# Altium schematic sheet Main.SchDoc
size 420 x 297 mm
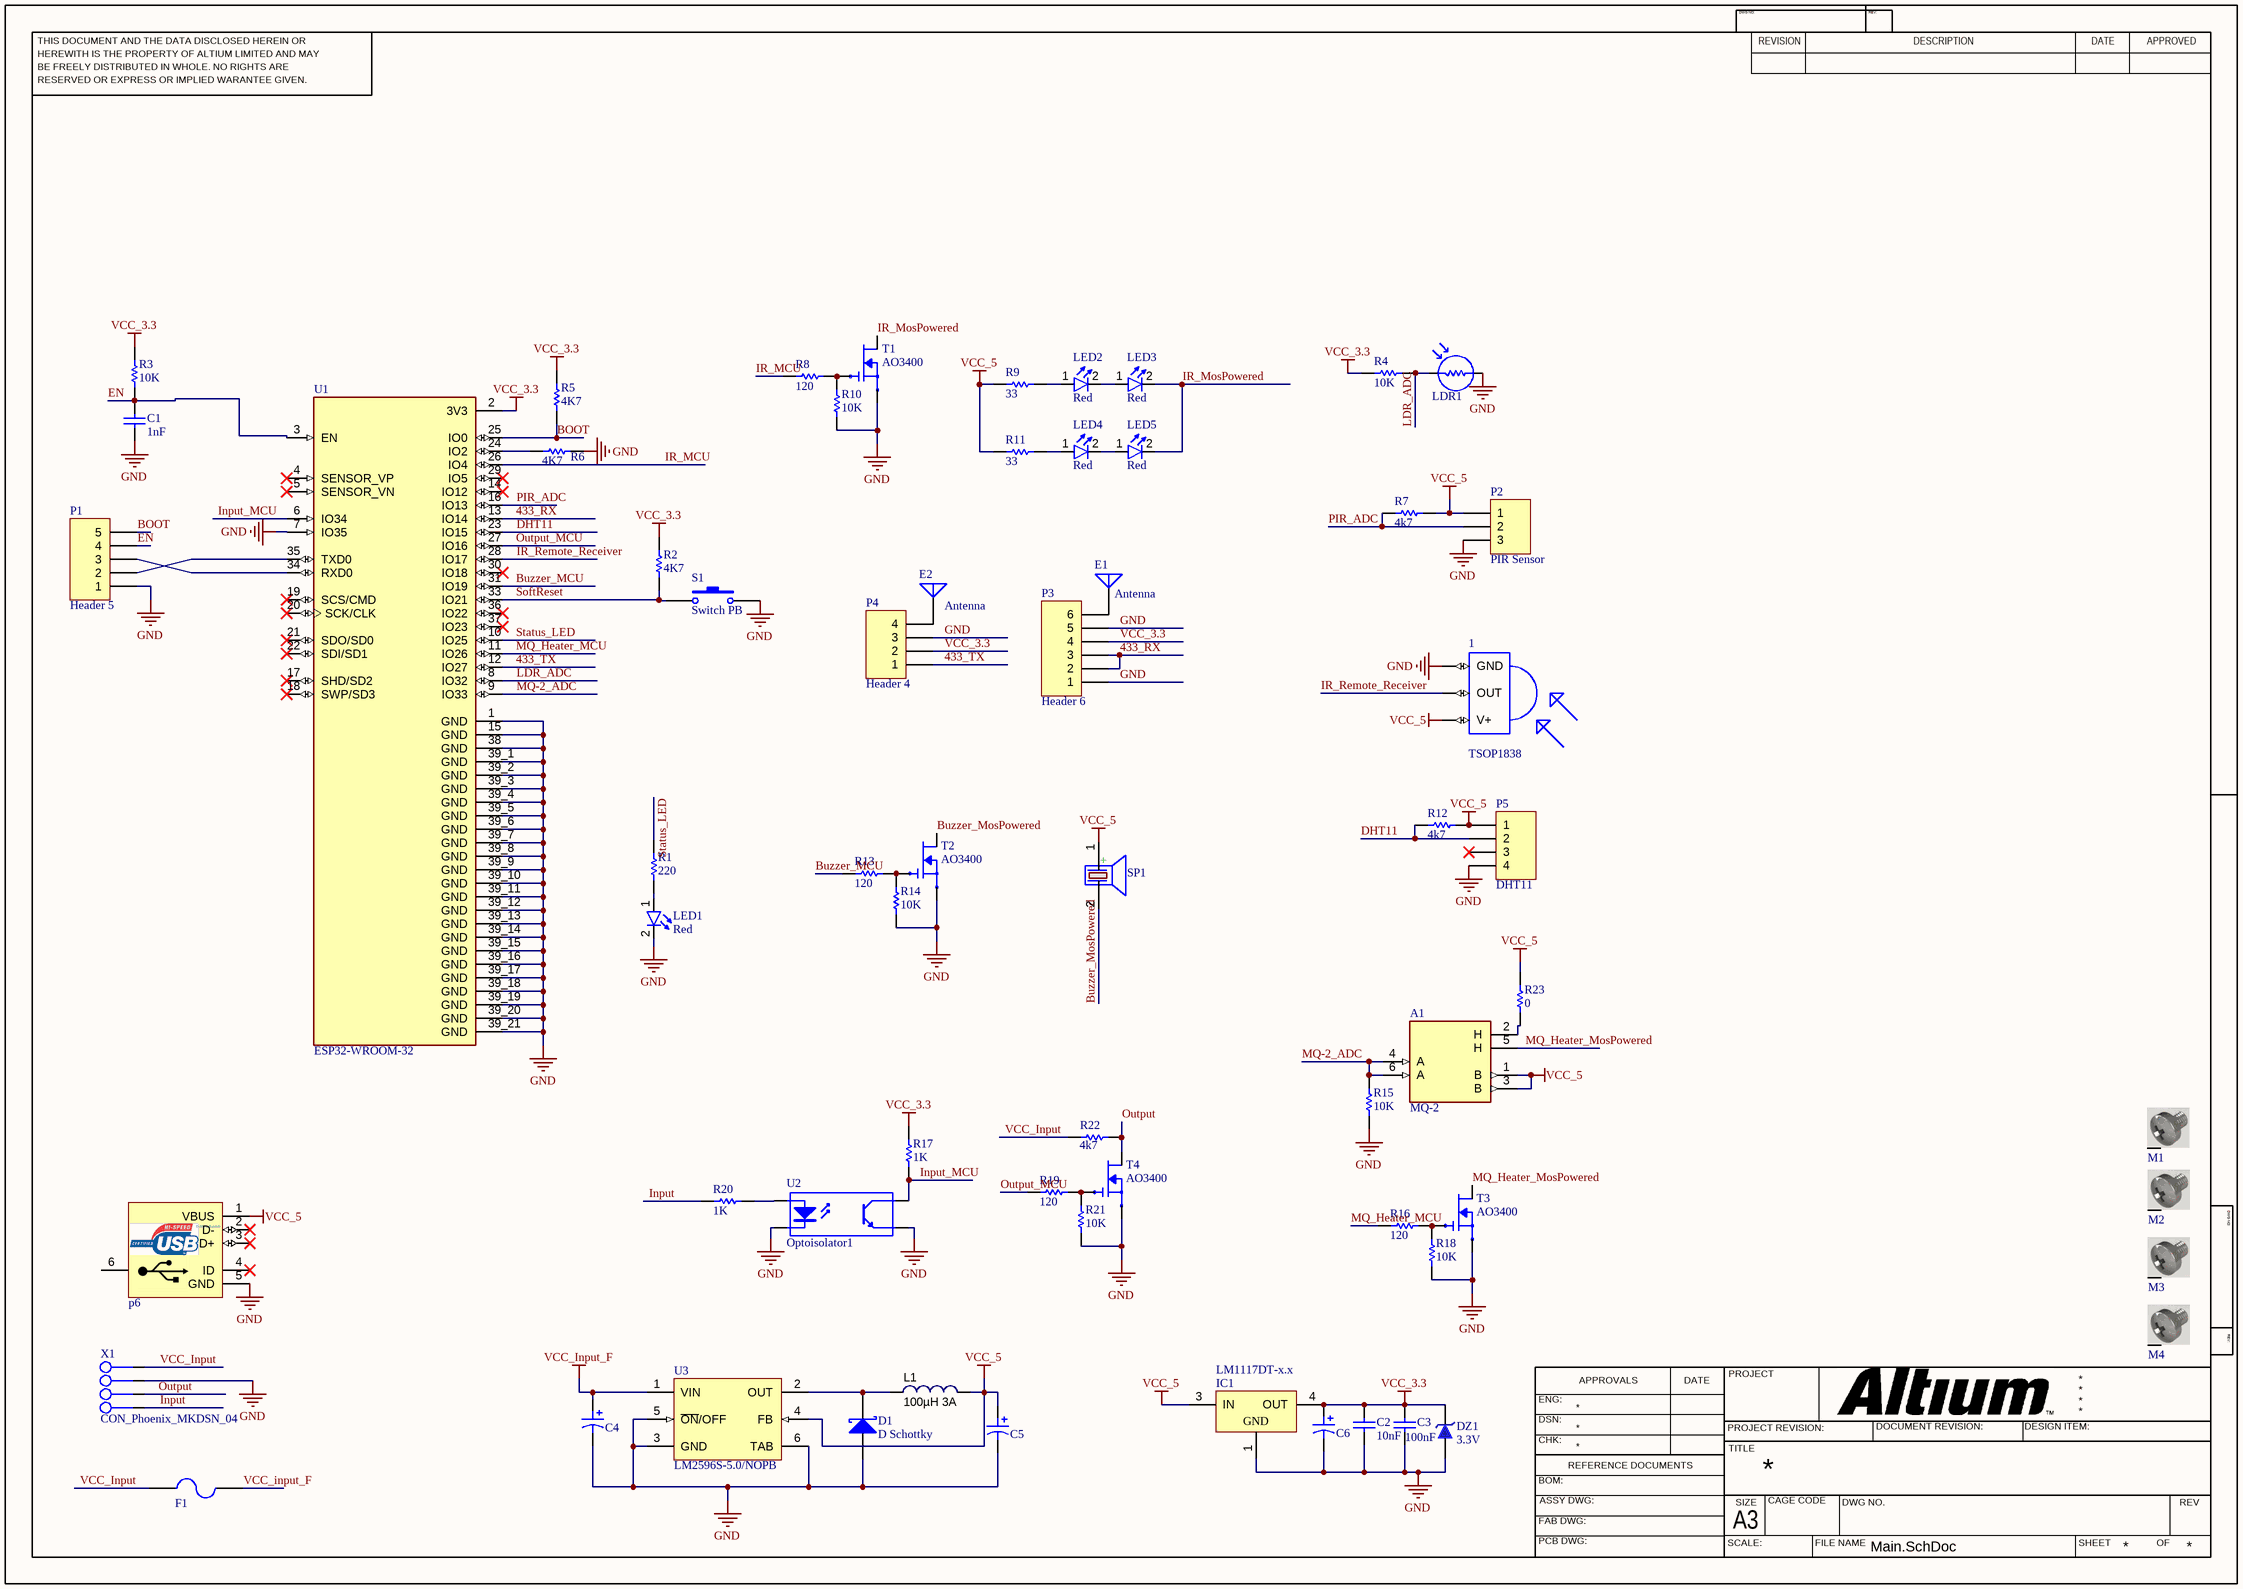
[diagram p0: Main.SchDoc]

## Parts
1  TSOP1838  [TSOP18XX]
A1  MQ-2  [XDCR_MQ-7]
C1  1nF  [CAPC4817X12N]
C2  10nF  [CAPC3413X12N]
C3  100nF  [CAPC3413X12N]
C4  220uF16V  [Cap electrolitic radial 6x7-2.5]  (value not drawn)
C5  (no value)  [Cap electrolitic radial 6x7-2.5]
C6  2200uf  [Cap electrolitic radial 6x7-2.5]  (value not drawn)
D1  D Schottky  [SMB]
DZ1  3.3V  [SOD80, LL-34]
E1  Antenna  [PIN1]
E2  Antenna  [PIN1]
F1  F=1.0 A  [1206 FUSE]  (value not drawn)
IC1  LM1117DT-x.x  [TD03B_N]
L1  100µH 3A  [Inductor 10x12 (200 mils)]
LDR1  PhotoCell  [PhotoCell]  (value not drawn)
LED1  Red  [LED-5mm]
LED2  Red  [LED-5mm-IR]
LED3  Red  [LED-5mm-IR]
LED4  Red  [LED-5mm-IR]
LED5  Red  [LED-5mm-IR]
M1  Screw  [Board Screw_No Silk]  (value not drawn)
M2  Screw  [Board Screw_No Silk]  (value not drawn)
M3  Screw  [Board Screw_No Silk]  (value not drawn)
M4  Screw  [Board Screw_No Silk]  (value not drawn)
P1  Header 5  [HDR1X5]
P2  PIR Sensor  [HDR1X3]
P3  Header 6  [HDR1X6]
P4  Header 4  [HDR1X4]
P5  DHT11  [HDR1X4]
p6  USB Connector  [USB_AB_BM_SHS]  (value not drawn)
R1  220  [RESC3413X04N]
R2  4K7  [RESC3413X04N]
R3  10K  [RESC3413X04N]
R4  10K  [RESC3413X04N]
R5  4K7  [RESC3413X04N]
R6  4K7  [RESC3413X04N]
R7  4k7  [RESC3413X04N]
R8  120  [RESC3413X04N]
R9  33  [RESC4817X04N]
R10  10K  [RESC3413X04N]
R11  33  [RESC4817X04N]
R12  4k7  [RESC3413X04N]
R13  120  [RESC3413X04N]
R14  10K  [RESC3413X04N]
R15  10K  [RESC3413X04N]
R16  120  [RESC3413X04N]
R17  1K  [RESC3413X04N]
R18  10K  [RESC3413X04N]
R19  120  [RESC3413X04N]
R20  1K  [RESC3413X04N]
R21  10K  [RESC3413X04N]
R22  4k7  [RESC3413X04N]
R23  0  [RESC4817X04N]
S1  Switch PB  [Switch - Push to On]
SP1  (no value)  [BUZZER 7.62mm DC]
T1  AO3400  [SOT23]
T2  AO3400  [SOT23]
T3  AO3400  [SOT23]
T4  AO3400  [SOT23]
U1  ESP32-WROOM-32  [MODULE_ESP32-WROOM-32]
U2  Optoisolator1  [DIP-4]
U3  LM2596S-5.0/NOPB  [TS5B_N]
X1  CON_Phoenix_MKDSN_04  [CON_MKDSN1,5/4-5,08]

## Nets
GND: 1.GND C1.1 C2.1 C3.1 C4.2 C5.2 C6.2 D1.1(A) DZ1.1 IC1.1(GND) LDR1.2 LED1.2(K) P1.1 P2.3 P3.1 P3.5 P4.3 P5.4 p6.5(GND) R6.1 R10.1 R14.1 R15.2 R18.1 R21.1 S1.2 T1.2(S) T2.2(S) T3.2(S) T4.2(S) U1.1(GND) U1.7(IO35) U1.15(GND) U1.38(GND) U1.39_1(GND) U1.39_2(GND) U1.39_3(GND) U1.39_4(GND) U1.39_5(GND) U1.39_6(GND) U1.39_7(GND) U1.39_8(GND) U1.39_9(GND) U1.39_10(GND) U1.39_11(GND) U1.39_12(GND) U1.39_13(GND) U1.39_14(GND) U1.39_15(GND) U1.39_16(GND) U1.39_17(GND) U1.39_18(GND) U1.39_19(GND) U1.39_20(GND) U1.39_21(GND) U2.2(K) U2.3(E) U3.3(GND) U3.5(~{ON}/OFF) U3.6(TAB) X1.3
VCC_3.3: C2.2 C3.2 C6.1 DZ1.2 IC1.4(OUT) P3.4 P4.2 R2.2 R3.2 R4.2 R5.2 R17.2 U1.2(3V3)
VCC_5: 1.VCC(V+) A1.1(B) A1.3(B) C5.1 IC1.3(IN) L1.2 P2.1 P5.1 p6.1(VBUS) R7.1 R9.2 R11.2 R12.1 R23.1 SP1.1(+) U3.4(FB)
VCC_input_F: C4.1 F1.2 U3.1(VIN)
433_RX: P3.2 P3.3 U1.13(IO14)
433_TX: P4.1 U1.12(IO27)
BOOT: P1.5 R5.1 U1.25(IO0)
Buzzer_MCU: R13.1 U1.31(IO19)
Buzzer_MosPowered: SP1.2(-) T2.3(D)
DHT11: P5.2 R12.2 U1.23(IO15)
EN: C1.2 P1.4 R3.1 U1.3(EN)
Input: R20.2 X1.1
Input_MCU: R17.1 U1.6(IO34) U2.4(C)
IR_MCU: R8.1 U1.26(IO4)
IR_MosPowered: LED3.2(K) LED5.2(K) T1.3(D)
IR_Remote_Receiver: 1.OUT U1.28(IO17)
LDR_ADC: LDR1.1 R4.1 U1.8(IO32)
MQ-2_ADC: A1.4(A) A1.6(A) R15.1 U1.9(IO33)
MQ_Heater_MCU: R16.1 U1.11(IO26)
MQ_Heater_MosPowered: A1.5(H) T3.3(D)
Output: R22.2 T4.3(D) X1.2
Output_MCU: R19.1 U1.27(IO16)
PIR_ADC: P2.2 R7.2 U1.16(IO13)
SoftReset: R2.1 S1.1 U1.33(IO21)
Status_LED: R1.2 U1.10(IO25)
VCC_Input: F1.1 R22.1 X1.4
NetA1_2: A1.2(H) R23.2
NetD1_2: D1.2(K) L1.1 U3.2(OUT)
NetE1_1: E1.1(A) P3.6
NetE2_1: E2.1(A) P4.4
NetLED1_1: LED1.1(A) R1.1
NetLED2_1: LED2.1(A) R9.1
NetLED2_2: LED2.2(K) LED3.1(A)
NetLED4_1: LED4.1(A) R11.1
NetLED4_2: LED4.2(K) LED5.1(A)
NetP1_2: P1.2 U1.35(TXD0)
NetP1_3: P1.3 U1.34(RXD0)
NetR6_2: R6.2 U1.24(IO2)
NetR8_2: R8.2 R10.2 T1.1(G)
NetR13_2: R13.2 R14.2 T2.1(G)
NetR16_2: R16.2 R18.2 T3.1(G)
NetR19_2: R19.2 R21.2 T4.1(G)
NetR20_1: R20.1 U2.1(A)

Not connected (* = marked no-connect by the designer): M1 S; M2 S; M3 S; M4 S; P5 3*; p6 2(D-)* 3(D+)* 4(ID)* 6(MH); U1 4(SENSOR_VP)* 5(SENSOR_VN)* 14(IO12)* 17(SHD/SD2)* 18(SWP/SD3)* 19(SCS/CMD)* 20(SCK/CLK)* 21(SDO/SD0)* 22(SDI/SD1)* 29(IO5)* 30(IO18)* 36(IO22)* 37(IO23)*

## Notes on the sheet
- THIS DOCUMENT AND THE DATA DISCLOSED HEREIN OR
- HEREWITH IS THE PROPERTY OF ALTIUM LIMITED AND MAY
- DWG NO:
- REVISION
- REV:
- DESCRIPTION
- DATE
- APPROVED
- BE FREELY DISTRIBUTED IN WHOLE. NO RIGHTS ARE
- RESERVED OR EXPRESS OR IMPLIED WARANTEE GIVEN.
- ENG:
- APPROVALS
- PROJECT
- DSN:
- CHK:
- REFERENCE DOCUMENTS
- PROJECT REVISION:
- TITLE
- DOCUMENT REVISION:
- DESIGN ITEM:
- BOM:
- FAB DWG:
- PCB DWG:
- ASSY DWG:
- SCALE:
- A3
- SIZE
- CAGE CODE
- FILE NAME
- DWG NO.
- SHEET
- OF
- REV
- (in symbol USB AB MICRO CONNECTOR) D:AbbasBasereh

## Library data of the parts
1 = TSOP1838: IR Remote Receiver 38KHz 35m 3-Pin; MF: Vishay; Price: None; SnapEDA_Link: https://www.snapeda.com/parts/TSOP1838/Vishay/view-part/561684/?ref=snap; Availability: Unavailable; Value: *; MP: TSOP1838; Package: None
A1 = MQ-7: Gas Sensor, High sensitivity to carbon monoxide; MF: Hanwei Electronics Co., Ltd; Price: None; Availability: Unavailable; MP: MQ-7; Package: Package; SnapEDA_Link: https://www.snapeda.com/parts/MQ-7/Hanwei%20Electronics%20Co.,%20Ltd/view-part/5661821/?ref=snap; Check_prices: https://www.snapeda.com/parts/MQ-7/Hanwei%20Electronics%20Co.,%20Ltd/view-part/5661821/?ref=eda; Value: *
C1 = CAP SMD 1206: CAP 1206; Designer: Abbas Basereh; Desc.: CAP SMD 1206; Data: 16-12-2016
C2 C3 = CAP SMD 0805: CAP 0805; Designer: Abbas Basereh; Desc.: CAP SMD 0805; Data: 16-12-2016
C4 = Cap ELECTROLITIC TOTAL SIZE: Cap electrolitic radial; Designer: Abbas Basereh; Data: 16-12-2016; Part. No: *; VALUE: 220uF16V
C5 C6 = Cap ELECTROLITIC TOTAL SIZE: Cap electrolitic radial; Designer: Abbas Basereh; VALUE: 2200uF6.3V; Data: 16-12-2016; Part. No: *
D1 = D Schottky: Schottky Diode; PartNumber: 1N5822; Published: 8-Jun-2000; LatestRevisionDate: 17-Jul-2002; LatestRevisionNote: Re-released for DXP Platform.; PackageReference: SMB; Publisher: Altium Limited; PackageDescription: DO-214-AA/SMB; 2 C-Bend Leads; Body 5.3 x 3.6 mm, inc. leads (LxW); Code_JEDEC: DO-214-AA
DZ1 = ZENER GENERAL DIODE: DIODE ZENER GENERAL; Published: 2017-1-12; PackageVersion: 2017-1-12; PackageReference: DO 35; Publisher: Abbas Basereh; PackageDescription: DIODE GEN ZENER; ComponentLink1Description: Manufacturer Link; ComponentLink2Description: Datasheet; VALUE: 3.3V
E1 E2 = Antenna: Generic Antenna; Published: 24-Mar-1999; LatestRevisionDate: 17-Jul-2002; LatestRevisionNote: Re-released for DXP Platform.; PackageReference: PIN1; Publisher: Altium Limited
F1 = Fuse SMD1206: SMD Fuses 1206; Designer: Abbas Basereh; Desc.: SMD Fuses 1206; Data: 16-12-2016
IC1 = LM1117DT-3.3: x.x Volt, 800mA Low-Dropout Linear Regulator, 3-pin TO-252; Manufacturer: National Semiconductor; PackageTopMarking: NSUZXYTT*LM1117*DT-X.X; PowerWise: N; CompType: LDO IC; DatasheetVersion: Apr-2006; PackageVersion: revD, Feb-2009; PackageReference: TD03B; PackageDescription: TO252, Molded, Jedec, 6.8 x 6.10 x 2.30mm Body, 3 Lead, 2.28mm Pitch, Surface Mount; Supplier 1: Farnell; Supplier 2: Farnell; PartNumber: LM1117DT-3.3; RoHS: N; PinCount: 3; Code_JEDEC: TO-252-AA; ComponentLink1Description: LM1117 Datasheet; ComponentLink1URL: http://www.national.com/ds/LM/LM1117.pdf; ComponentLink2Description: LM1117 Web Page; ComponentLink2URL: http://www.national.com/pf/LM/LM1117.html; ComponentLink3Description: TD03B Package Page; ComponentLink3URL: http://www.national.com/packaging/folders/td03b.html
L1 = POWER INDUCTOR 10x12 (200 mils): Tolerance: ±20%; Type: Ferrite Core; SCDType: source; Package / Case: POWER INDUCTOR 10x12 (200 mils); Supplier 1: Digi-Key; Operating Temperature: -40°C ~ 125°C; Value: 100µH 3A; PUBLISHER: ABBAS BASEREH  2017-3-1
LDR1 = LDR: Photo Cell- Variable Resistor With Light; Company: IPA CO.; Designer: Saeid Jorablo; Last Update Time: 2008/07/17
LED1-LED5 = LED: Designer: Saeid Jorablo; Organazation: ControTec; Adding Date: 1387/12/22; Color: Red
M1-M4 = Board Screw: Board Screw With Spacer
P1 = Header 5: Header, 5-Pin; LatestRevisionDate: 17-Jul-2002; LatestRevisionNote: Re-released for DXP Platform.; Publisher: Altium Limited
P2 = Header 3: Header, 3-Pin; LatestRevisionDate: 17-Jul-2002; LatestRevisionNote: Re-released for DXP Platform.; Publisher: Altium Limited
P3 = Header 6: Header, 6-Pin; LatestRevisionDate: 17-Jul-2002; LatestRevisionNote: Re-released for DXP Platform.; Publisher: Altium Limited
P4 P5 = Header 4: Header, 4-Pin; LatestRevisionDate: 17-Jul-2002; LatestRevisionNote: Re-released for DXP Platform.; Publisher: Altium Limited
p6 = USB AB MICRO CONNECTOR: USB MICRO-B Type Connector; Designer: ABBAS BASEREH; Max Current: 1600mA; Mounting Technology: Surface Mount\Through-Hole; Category: Connector; Pin Count: 5-7; Publisher: ABBAS BASEREH; Status: Unreleased; ComponentLink1Description: Datasheet; ComponentLink2Description: Reference; Update: 1395-11-17
R1-R8 R10 R12-R22 = RES 0805 0.125W: RES 0805; Designer: Abbas Basereh; Desc.: RES SMD 0805; Data: 16-12-2016
R9 R11 R23 = RES 1206 0.25W: RES 1206; Designer: Abbas Basereh; Desc.: RES SMD 1206; Data: 16-12-2016
S1 = Switch PB: Push Button Switch
SP1 = PIEZO BUZZER: PIEZO BUZZER ACTIVE; Designer: Abbas Basereh; Comment_1: SPEAKER AND BEEP; Design Date: 1395/11/14; ComponentLink2Description: Reference; PackageDescription: THD; Publisher: Abbas Basereh; Mounting Technology: THD; Pin Count: 2; Status: Unreleased
T1-T4 = AO3400: N-Channel 30V 5.8A _Ta_ 1.4W _Ta_ Surface Mount SOT-23-3; MF: Alpha &; MP: AO3400; Availability: Unavailable; Value: *; Price: None; SnapEDA_Link: https://www.snapeda.com/parts/AO3400/Alpha%20%26%20Omega%20Semiconductor%20Inc./view-part/1321993/?ref=snap; Package: SOT-23-3 Alpha &amp; Omega Semiconductor
U1 = ESP32-WROOM-32: Bluetooth, WiFi Transceiver Module 2.4GHz ~ 2.5GHz Surface Mount; MF: Espressif Systems; Package: Module Espressif Systems; Digi-Key_Part_Number: 1904-1010-1-ND; Digi-Key_Purchase_URL: https://www.digikey.com/product-detail/en/espressif-systems/ESP32-WROOM-32/1904-1010-1-ND/8544305?utm_source=snapeda&utm_medium=aggregator&utm_campaign=symbol; Value: *; MP: ESP32-WROOM-32; SnapEDA_Link: https://www.snapeda.com/parts/ESP32-WROOM-32/Espressif%20Systems/view-part/2753322/?ref=snap
U2 = Optoisolator1: 4-Pin Phototransistor Optocoupler; Published: 24-Mar-1999; LatestRevisionDate: 04-Mar-2005; LatestRevisionNote: Sch pins 3 & 4 Swapped.; DatasheetVersion: Nov-2003; PackageReference: DIP-4; Publisher: Altium Limited
U3 = LM2596S-5.0/NOPB: SIMPLE SWITCHER® Power Converter 150 KHz 3A Step-Down Voltage Regulator, 5-pin TO-263, Pb-Free; Manufacturer: National Semiconductor; PackageTopMarking: NSUZXYTTE#*LM2596S*-5.0 P+; PowerWise: N; High-Reliability: Y; DatasheetVersion: May-2002; PackageVersion: revD, Apr-2005; PackageReference: TS5B; PackageDescription: TO-263, Molded, .400 x .390 x .180in, 5 Lead, .067in Pitch, Surface Mount; PartNumber: LM2596S-5.0/NOPB; RoHS: Y; PinCount: 5; CompType: Switcher; Code_JEDEC: MO-169-AB; ComponentLink1Description: Manufacturer URL; ComponentLink1URL: http://www.national.com/; ComponentLink2Description: LM2596 Datasheet; ComponentLink2URL: http://www.national.com/ds/LM/LM2596.pdf; ComponentLink3Description: LM2596 Web Page; ComponentLink3URL: http://www.national.com/pf/LM/LM2596.html; ComponentLink4Description: TS5B Package Page; ComponentLink4URL: http://www.national.com/packaging/folders/ts5b.html
X1 = CON_Phoenix_MKDSN_04: Manufacturer: PHOENIX CONTACT; Company: SJ Libraries; Connector type: PCB Terminal Block; designer: Eng. Saeid Jorablo; Max Current: 13.5 A; Positions: 4; Revision 1: 2012/10/1 : Adding Model; Voltage: 400 V; Category: Connector; ComponentLink1Description: Datasheet; ComponentLink2Description: Reference; HelpURL: http://s3.picofile.com/file/7443264187/Coming_Soon_logo.gif; Mounting Technology: Through-Hole; Pin Count: 4; Publisher: SJ UnLimited; Status: Unreleased; Update: 2012/10/1